# Altium schematic sheet pca10056_sheet4_interface_mcu.SchDoc: PCA10056 - Interface MCU
size A3; Revision: 0.9.0; SheetNumber: 4; SheetTotal: 7; Author: RUBR; DrawnBy: RUBR; ProjectNumber: 4440; PCAName: PCA10056; PCBRevision: 0240RUBR; DocumentSize: A3; PCBNumber: 400236; ProjectName: nRF52840-DK
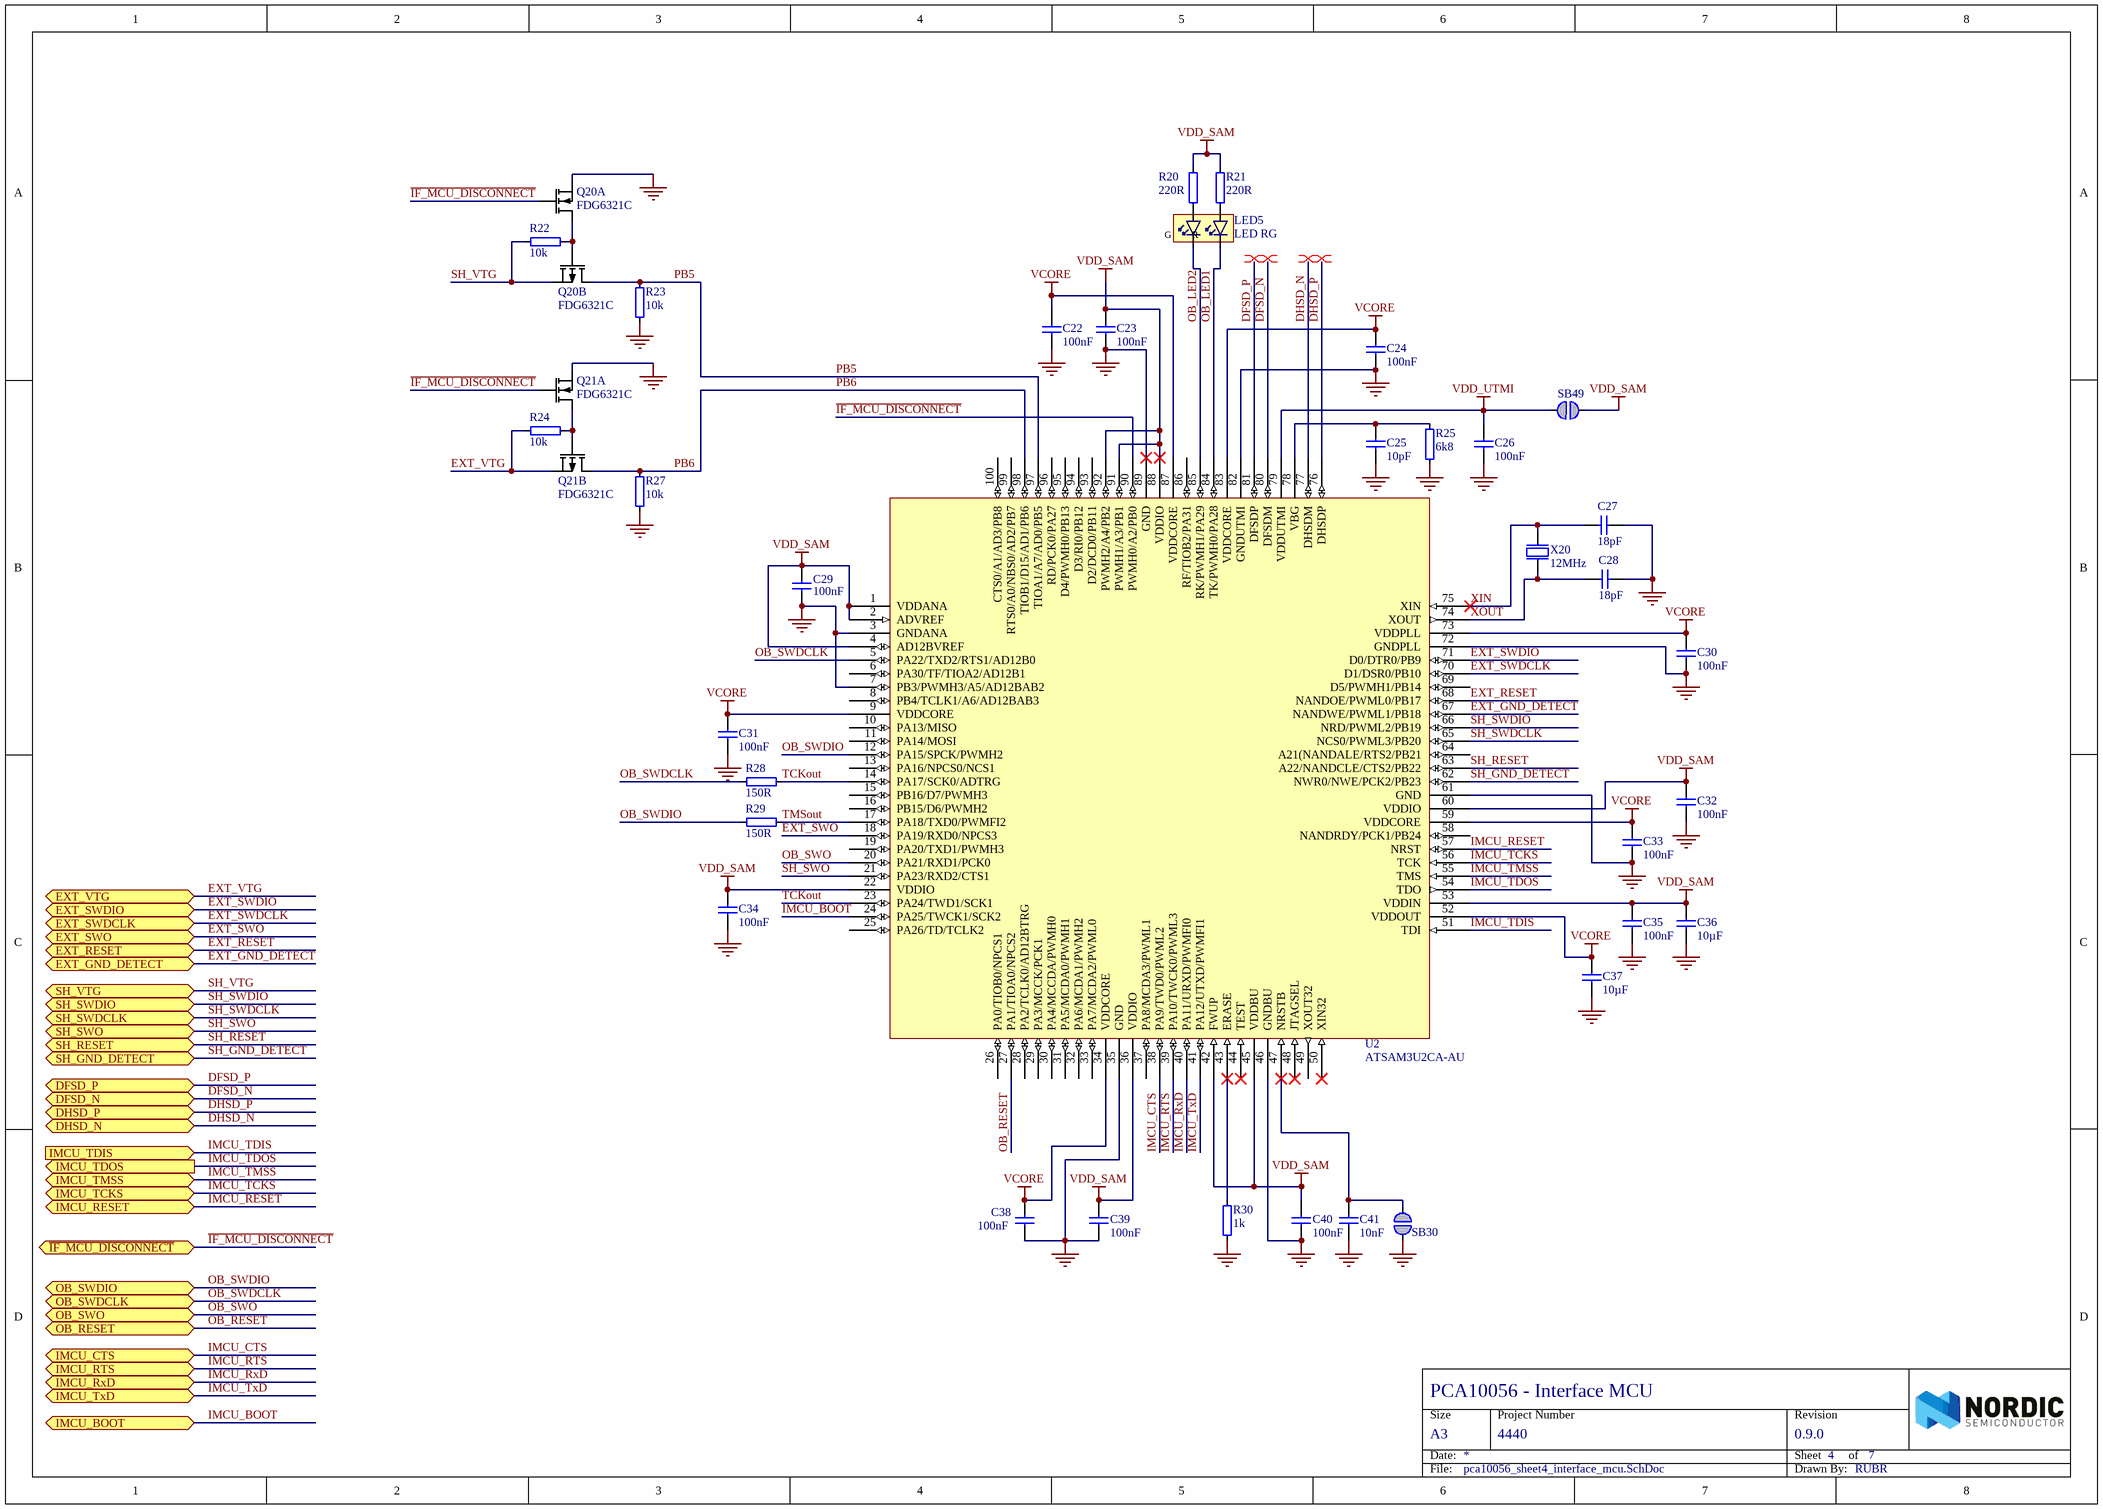
[diagram p0: pca10056_sheet4_interface_mcu.SchDoc]

## Parts
C22  100nF  [CAPC1005X04L]
C23  100nF  [CAPC1005X04L]
C24  100nF  [CAPC1005X04L]
C25  10pF  [CAPC1005X04L]
C26  100nF  [CAPC1005X04L]
C27  18pF  [CAPC1005X04L]
C28  18pF  [CAPC1005X04L]
C29  100nF  [CAPC1005X04L]
C30  100nF  [CAPC1005X04L]
C31  100nF  [CAPC1005X04L]
C32  100nF  [CAPC1005X04L]
C33  100nF  [CAPC1005X04L]
C34  100nF  [CAPC1005X04L]
C35  100nF  [CAPC1005X04L]
C36  10µF  [CAPC1608X06L]
C37  10µF  [CAPC1608X06L]
C38  100nF  [CAPC1005X04L]
C39  100nF  [CAPC1005X04L]
C40  100nF  [CAPC1005X04L]
C41  10nF  [CAPC1005X04L]
LED5  LED RG  [LED_DUAL_0606]
Q20  FDG6321C  [SOT65P210X100-6N]  (parts A,B of 2)
Q21  FDG6321C  [SOT65P210X100-6N]  (parts A,B of 2)
R20  220R  [RESC1005X04L]
R21  220R  [RESC1005X04L]
R22  10k  [RESC1005X04L]
R23  10k  [RESC1005X04L]
R24  10k  [RESC1005X04L]
R25  6k8  [RESC1005X04L]
R27  10k  [RESC1005X04L]
R28  150R  [RESC1005X04L]
R29  150R  [RESC1005X04L]
R30  1k  [RESC1005X04L]
SB30  Solderbridge  [Solderbridge]  (value not drawn)  (no BOM)
SB49  Solderbridge  [Solderbridge]  (value not drawn)  (no BOM)
U2  ATSAM3U2CA-AU  [TSQFP50P1600X1600X160-100N]
X20  12MHz  [BT-XTAL_3225]

## Ports
DFSD_N (bidir), DFSD_P (bidir), DHSD_N (bidir), DHSD_P (bidir), EXT_GND_DETECT (bidir), EXT_RESET (bidir), EXT_SWDCLK (bidir), EXT_SWDIO (bidir), EXT_SWO (bidir), EXT_VTG (bidir), IMCU_BOOT (bidir), IMCU_CTS (bidir), IMCU_RESET (bidir), IMCU_RTS (bidir), IMCU_RxD (bidir), IMCU_TCKS (bidir), IMCU_TDIS (in), IMCU_TDOS (out), IMCU_TMSS (bidir), IMCU_TxD (bidir), OB_RESET (bidir), OB_SWDCLK (bidir), OB_SWDIO (bidir), OB_SWO (bidir), SH_GND_DETECT (bidir), SH_RESET (bidir), SH_SWDCLK (bidir), SH_SWDIO (bidir), SH_SWO (bidir), SH_VTG (bidir), ~{IF_MCU_DISCONNECT} (bidir)

## Nets
GND: C22.1 C23.1 C24.1 C25.1 C26.1 C27.2 C28.2 C29.1 C30.2 C31.1 C32.1 C33.1 C34.1 C35.1 C36.1 C37.1 C38.1 C39.1 C40.1 C41.1 Q20.1(S1) Q21.1(S1) R23.1 R25.1 R27.1 R30.1 SB30.2 U2.3(GNDANA) U2.7(PB3/PWMH3/A5/AD12BAB2) U2.35(GND) U2.46(GNDBU) U2.61(GND) U2.72(GNDPLL) U2.82(GNDUTMI) U2.89(GND) X20.2(GND) X20.4(GND)
VCORE: C22.2 C24.2 C30.1 C31.2 C33.2 C37.2 C38.2 U2.9(VDDCORE) U2.34(VDDCORE) U2.52(VDDOUT) U2.59(VDDCORE) U2.73(VDDPLL) U2.83(VDDCORE) U2.87(VDDCORE)
VDD_SAM: C23.2 C29.2 C32.2 C34.2 C35.2 C36.2 C39.2 C40.2 R20.2 R21.2 SB49.1 U2.1(VDDANA) U2.2(ADVREF) U2.4(AD12BVREF) U2.22(VDDIO) U2.36(VDDIO) U2.42(FWUP) U2.45(VDDBU) U2.53(VDDIN) U2.60(VDDIO) U2.88(VDDIO) U2.91(PWMH1/A3/PB1) U2.92(PWMH2/A4/PB2)
VDD_UTMI: C26.2 SB49.2 U2.79(VDDUTMI)
DFSD_N: U2.80(DFSDM) ; port DFSD_N
DFSD_P: U2.81(DFSDP) ; port DFSD_P
DHSD_N: U2.77(DHSDM) ; port DHSD_N
DHSD_P: U2.76(DHSDP) ; port DHSD_P
EXT_GND_DETECT: U2.67(NANDWE/PWML1/PB18) ; port EXT_GND_DETECT
EXT_RESET: U2.68(NANDOE/PWML0/PB17) ; port EXT_RESET
EXT_SWDCLK: U2.70(D1/DSR0/PB10) ; port EXT_SWDCLK
EXT_SWDIO: U2.71(D0/DTR0/PB9) ; port EXT_SWDIO
EXT_SWO: U2.18(PA19/RXD0/NPCS3) ; port EXT_SWO
EXT_VTG: Q21.4(S2) R24.1 ; port EXT_VTG
~{IF_MCU_DISCONNECT}: Q20.2(G1) Q21.2(G1) U2.90(PWMH0/A2/PB0) ; port ~{IF_MCU_DISCONNECT}
IMCU_BOOT: U2.24(PA25/TWCK1/SCK2) ; port IMCU_BOOT
IMCU_CTS: U2.38(PA9/TWD0/PWML2) ; port IMCU_CTS
IMCU_RESET: U2.57(NRST) ; port IMCU_RESET
IMCU_RTS: U2.39(PA10/TWCK0/PWML3) ; port IMCU_RTS
IMCU_RxD: U2.40(PA11/URXD/PWMFI0) ; port IMCU_RxD
IMCU_TCKS: U2.56(TCK) ; port IMCU_TCKS
IMCU_TDIS: U2.51(TDI) ; port IMCU_TDIS
IMCU_TDOS: U2.54(TDO) ; port IMCU_TDOS
IMCU_TMSS: U2.55(TMS) ; port IMCU_TMSS
IMCU_TxD: U2.41(PA12/UTXD/PWMFI1) ; port IMCU_TxD
OB_LED1: LED5.4(C1) U2.84(TK/PWMH0/PA28)
OB_LED2: LED5.3(C2) U2.85(RK/PWMH1/PA29)
OB_RESET: U2.27(PA1/TIOA0/NPCS2) ; port OB_RESET
OB_SWDCLK: R28.2 U2.5(PA22/TXD2/RTS1/AD12B0) ; port OB_SWDCLK
OB_SWDIO: R29.2 U2.12(PA15/SPCK/PWMH2) ; port OB_SWDIO
OB_SWO: U2.20(PA21/RXD1/PCK0) ; port OB_SWO
PB5: Q20.3(D2) R23.2 U2.97(TIOA1/A7/AD0/PB5)
PB6: Q21.3(D2) R27.2 U2.98(TIOB1/D15/AD1/PB6)
SH_GND_DETECT: U2.62(NWR0/NWE/PCK2/PB23) ; port SH_GND_DETECT
SH_RESET: U2.63(A22/NANDCLE/CTS2/PB22) ; port SH_RESET
SH_SWDCLK: U2.65(NCS0/PWML3/PB20) ; port SH_SWDCLK
SH_SWDIO: U2.66(NRD/PWML2/PB19) ; port SH_SWDIO
SH_SWO: U2.21(PA23/RXD2/CTS1) ; port SH_SWO
SH_VTG: Q20.4(S2) R22.1 ; port SH_VTG
TCKout: R28.1 U2.14(PA17/SCK0/ADTRG) U2.23(PA24/TWD1/SCK1)
TMSout: R29.1 U2.17(PA18/TXD0/PWMFI2)
XIN: C27.1 U2.75(XIN) X20.3(out)
XOUT: C28.1 U2.74(XOUT) X20.1(inp)
NetC25_2: C25.2 R25.2 U2.78(VBG)
NetC41_2: C41.2 SB30.1 U2.47(NRSTB)
NetLED5_1: LED5.1(A2) R20.1
NetLED5_2: LED5.2(A1) R21.1
NetQ20_5: Q20.5(G2) Q20.6(D1) R22.2
NetQ21_5: Q21.5(G2) Q21.6(D1) R24.2
NetR30_2: R30.2 U2.43(ERASE)

Not connected (* = marked no-connect by the designer): U2 6(PA30/TF/TIOA2/AD12B1) 8(PB4/TCLK1/A6/AD12BAB3) 10(PA13/MISO) 11(PA14/MOSI) 13(PA16/NPCS0/NCS1) 15(PB16/D7/PWMH3) 16(PB15/D6/PWMH2) 19(PA20/TXD1/PWMH3) 25(PA26/TD/TCLK2) 26(PA0/TIOB0/NPCS1) 28(PA2/TCLK0/AD12BTRG) 29(PA3/MCCK/PCK1) 30(PA4/MCCDA/PWMH0) 31(PA5/MCDA0/PWMH1) 32(PA6/MCDA1/PWMH2) 33(PA7/MCDA2/PWML0) 37(PA8/MCDA3/PWML1) 44(TEST)* 48(JTAGSEL)* 49(XOUT32) 50(XIN32)* 58(NANDRDY/PCK1/PB24) 64(A21(NANDALE/RTS2/PB21) 69(D5/PWMH1/PB14) 86(RF/TIOB2/PA31) 93(D2/DCD0/PB11) 94(D3/RI0/PB12) 95(D4/PWMH0/PB13) 96(RD/PCK0/PA27) 99(RTS0/A0/NBS0/AD2/PB7) 100(CTS0/A1/AD3/PB8)

## Layout directives
differential pair: DFSD_N, DFSD_P, DHSD_N, DHSD_P

## Notes on the sheet
- Size
- Date:
- Project Number
- Sheet         of
- Revision
- File:
- Drawn By:
- (in symbol LTST-C195KGJRKT) G; R

## Library data of the parts
C22-C24 C26 C29-C35 C38-C40 = C0402-100n: Capacitor, X7R, ±10%; Part number IPS: 00000005296; Note: 16V; Artikkelnr Noca: 20039200; Artikkelnr Simpro: N.A.; Part Number: C0402-100n; Manufacturer: *; Manufacturer Part Number: *; Datasheet: *; LatestRevisionDate: 2009-11-23; Pin Count: 2; Publisher: Nordic Semiconductor; Published: 2009-05-08; Value: 100nF; Supplier: *; Supplier part number: *; 2nd source Supplier: *; 2nd source part number: *; Footprint Doc: 0402
C25 = C0402-10p: Capacitor, NP0, ±2%; 2nd source part number: 185-6064; Note: 50V; Artikkelnr Noca: 20029260; Artikkelnr Simpro: N.A.; Part Number: C0402-10p; Manufacturer: *; Manufacturer Part Number: *; Datasheet: *; LatestRevisionDate: 2009-05-08; Pin Count: 2; Publisher: Nordic Semiconductor; Published: 2009-05-08; Value: 10pF; Supplier: Digi-Key; Supplier part number: 712-1252-1-ND; 2nd source Supplier: Farnell; Footprint Doc: 0402
C27 C28 = C0402-18p: Capacitor, NP0, ±5%; Note: 50V; Artikkelnr Noca: 20029209; Artikkelnr Simpro: N.A.; Part Number: C0402-18p; Manufacturer: *; Manufacturer Part Number: *; Datasheet: *; LatestRevisionDate: 2009-05-08; Pin Count: 2; Publisher: Nordic Semiconductor; Published: 2009-05-08; Value: 18pF; Supplier: *; Supplier part number: *; 2nd source Supplier: *; 2nd source part number: *; Footprint Doc: 0402
C36 C37 = C0603-10µ: Capacitor, X5R, ±20%; Part number IPS: 00000003029; Note: 6.3V; Artikkelnr Noca: 20039234; Artikkelnr Simpro: N.A.; Part Number: C0603-10µ; Manufacturer: *; Manufacturer Part Number: *; Datasheet: *; LatestRevisionDate: 2011-01-17; Pin Count: 2; Publisher: Nordic Semiconductor; Published: 2011-01-17; Value: 10µF; Supplier: *; Supplier part number: *; 2nd source Supplier: *; 2nd source part number: *; Footprint Doc: 0603
C41 = C0402-10n: Capacitor, X7R, ±10%; Part number IPS: 00000002386; Note: 16V; Artikkelnr Noca: 20039166; Artikkelnr Simpro: N.A.; Part Number: C0402-10n; Manufacturer: *; Manufacturer Part Number: *; Datasheet: *; LatestRevisionDate: 2009-11-23; Pin Count: 2; Publisher: Nordic Semiconductor; Published: 2009-05-08; Value: 10nF; Supplier: *; Supplier part number: *; 2nd source Supplier: *; 2nd source part number: *; Footprint Doc: 0402
LED5 = LTST-C195KGJRKT: Ultra bright AlInGaP Bi-Color LED; Manufacturer: Lite-On Inc; 2nd source part number: 859-LTST-C195KGJRKT; Artikkelnr Noca: 13019145; Artikkelnr Simpro: N.A.; Part Number: LTST-C195KGJRKT; Manufacturer Part Number: LTST-C195KGJRKT; Datasheet: http://media.digikey.com/pdf/Data%20Sheets/Lite-On%20PDFs/LTST-C195KGJRKT.pdf; LatestRevisionDate: 2013-02-11; Pin Count: 4; Publisher: Nordic Semiconductor; Published: 2012-07-05; Value: LED RG; Note: *; Supplier: Digi-Key; Supplier part number: 160-1452-1-ND; 2nd source Supplier: Mouser; Footprint Doc: LED_DUAL_0606
Q20 Q21 = FDG6321C: Fairchild, FDG6321C, Dual N & P Channel Digital FET; 2nd source part number: FDG6321CCT-ND; Artikkelnr Noca: 35029089; Artikkelnr Simpro: N.A.; Part Number: FDG6321C; Manufacturer: Fairchild; Manufacturer Part Number: FDG6321C; Datasheet: http://www.fairchildsemi.com/ds/FD/FDG6321C.pdf; LatestRevisionDate: 2011-05-11; Pin Count: 6; Publisher: Nordic Semiconductor; Published: 2009-09-16; Value: FDG6321C; Note: Dual N & P Channel Digital FET; Supplier: Farnell; Supplier part number: 170-0689; 2nd source Supplier: Digi-Key; Footprint Doc: SC70-6
R20 R21 = R0402-220: Resistor, ±1%, 0.063W; Note: Chip Res 1%; Artikkelnr Noca: 27049057; Artikkelnr Simpro: N.A.; Value Ohm: 220; Part Number: R0402-220; Manufacturer: *; Manufacturer Part Number: *; Datasheet: *; LatestRevisionDate: 2009-11-23; Pin Count: 2; Publisher: Nordic Semiconductor; Published: 2009-05-08; Value: 220R; Supplier: Farnell; Supplier part number: 173-8841; 2nd source Supplier: *; 2nd source part number: *; Footprint Doc: 0402
R22-R24 R27 = R0402-10k: Resistor, ±1%, 0.063W; Part number IPS: 00000002093; Note: Chip Res 1%; Artikkelnr Noca: 27049097; Artikkelnr Simpro: N.A.; Value Ohm: 10000; Part Number: R0402-10k; Manufacturer: *; Manufacturer Part Number: *; Datasheet: *; LatestRevisionDate: 2009-11-23; Pin Count: 2; Publisher: Nordic Semiconductor; Published: 2009-05-08; Value: 10k; Supplier: Farnell; Supplier part number: 173-8864; 2nd source Supplier: *; 2nd source part number: *; Footprint Doc: 0402
R25 = R0402-6k8: Resistor, ±1%, 0.063W; Note: Chip Res 1%; Artikkelnr Noca: 27049093; Artikkelnr Simpro: N.A.; Value Ohm: 6800; Part Number: R0402-6k8; Manufacturer: *; Manufacturer Part Number: *; Datasheet: *; LatestRevisionDate: 2009-11-23; Pin Count: 2; Publisher: Nordic Semiconductor; Published: 2009-05-08; Value: 6k8; Supplier: Farnell; Supplier part number: 173-8862; 2nd source Supplier: *; 2nd source part number: *; Footprint Doc: 0402
R28 R29 = R0402-150: Resistor, ±1%, 0.063W; Note: Chip Res 1%; Artikkelnr Noca: 27049053; Artikkelnr Simpro: N.A.; Value Ohm: 150; Part Number: R0402-150; Manufacturer: *; Manufacturer Part Number: *; Datasheet: *; LatestRevisionDate: 2009-11-23; Pin Count: 2; Publisher: Nordic Semiconductor; Published: 2009-05-08; Value: 150R; Supplier: Farnell; Supplier part number: 173-8839; 2nd source Supplier: *; 2nd source part number: *; Footprint Doc: 0402
R30 = R0402-1k0: Resistor, ±1%, 0.063W; Part number IPS: 00000002218; Note: Chip Res 1%; Artikkelnr Noca: 27049073; Artikkelnr Simpro: N.A.; Value Ohm: 1000; Part Number: R0402-1k0; Manufacturer: *; Manufacturer Part Number: *; Datasheet: *; LatestRevisionDate: 2009-11-23; Pin Count: 2; Publisher: Nordic Semiconductor; Published: 2009-05-08; Value: 1k; Supplier: Farnell; Supplier part number: 173-8850; 2nd source Supplier: *; 2nd source part number: *; Footprint Doc: 0402
SB30 SB49 = Solderbridge: Artikkelnr Noca: N.A.; Part Number: Solderbridge; Manufacturer: *; Manufacturer Part Number: *; Datasheet: *; LatestRevisionDate: 2009-12-14; Pin Count: 2; Publisher: Nordic Semiconductor; Published: 2009-12-14; Value: Solderbridge; Note: *; Supplier: *; Supplier part number: *; 2nd source Supplier: *; 2nd source part number: *; Footprint Doc: Solderbridge; Artikkelnr Simpro: N.A.
U2 = ATSAM3U2CA-AU: IC MCU 32bit 128kB flash 100LQFP; Manufacturer: Atmel; 2nd source part number: 184-1662; Artikkelnr Noca: 15019073; Artikkelnr Simpro: N.A.; Part Number: ATSAM3U2CA-AU; Manufacturer Part Number: ATSAM3U2CA-AU; Datasheet: http://www.atmel.com/Images/6430s.pdf; LatestRevisionDate: 2012-06-01; Pin Count: 100; Publisher: Nordic Semiconductor; Published: 2012-06-01; Value: ATSAM3U2CA-AU; Note: *; Supplier: Digi-Key; Supplier part number: ATSAM3U2CA-AU-ND; 2nd source Supplier: Farnell; Footprint Doc: LQFP-100
X20 = XTAL_SMD3225_12MHz_18pF_TXC: XTAL SMD 3225, 12MHz, Cl=18pF, Tol: ±30ppm, Stab: ±30ppm; Manufacturer: TXC Corporation; Manufacturer Part Number: 7M-12.000MAAJ-T; 2nd source part number: 184-2056; Note: XTAL SMD 12.000MHz; Artikkelnr Noca: 22019166; Artikkelnr Simpro: N.A.; Part Number: XTAL_SMD3225_12MHz_18pF_TXC; Datasheet: http://www.txccrystal.com/images/pdf/7m.pdf; LatestRevisionDate: 2014-11-27; Pin Count: 4; Publisher: Nordic Semiconductor; Published: 2010-08-31; Value: 12MHz; Supplier: Digi-Key; Supplier part number: 887-1121-1-ND; 2nd source Supplier: Farnell; Footprint Doc: XTAL_3225